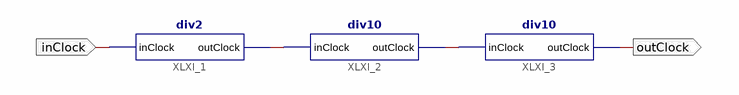
[diagram p0: schematic sheet 1]
// Xilinx ISE schematic ClockForSegment.sch (spartan6) as structural Verilog: 3 symbols, 2 ports
module ClockForSegment (
  input  inClock,
  output outClock
);

  wire XLXN_1, XLXN_2;

  div2 XLXI_1 (.inClock(inClock), .outClock(XLXN_1));
  div10 XLXI_2 (.inClock(XLXN_1), .outClock(XLXN_2));
  div10 XLXI_3 (.inClock(XLXN_2), .outClock(outClock));
endmodule
